# Altium schematic sheet 原理图.SchDoc: 声控电动窗帘控制器设计
size B; Organization: 河北科技大学; Revision: V1.0; SheetNumber: 1; SheetTotal: 1; Date: 2022/4/09; CheckedBy: 张刚; Author: 靳雅宁; Engineer: 180802205
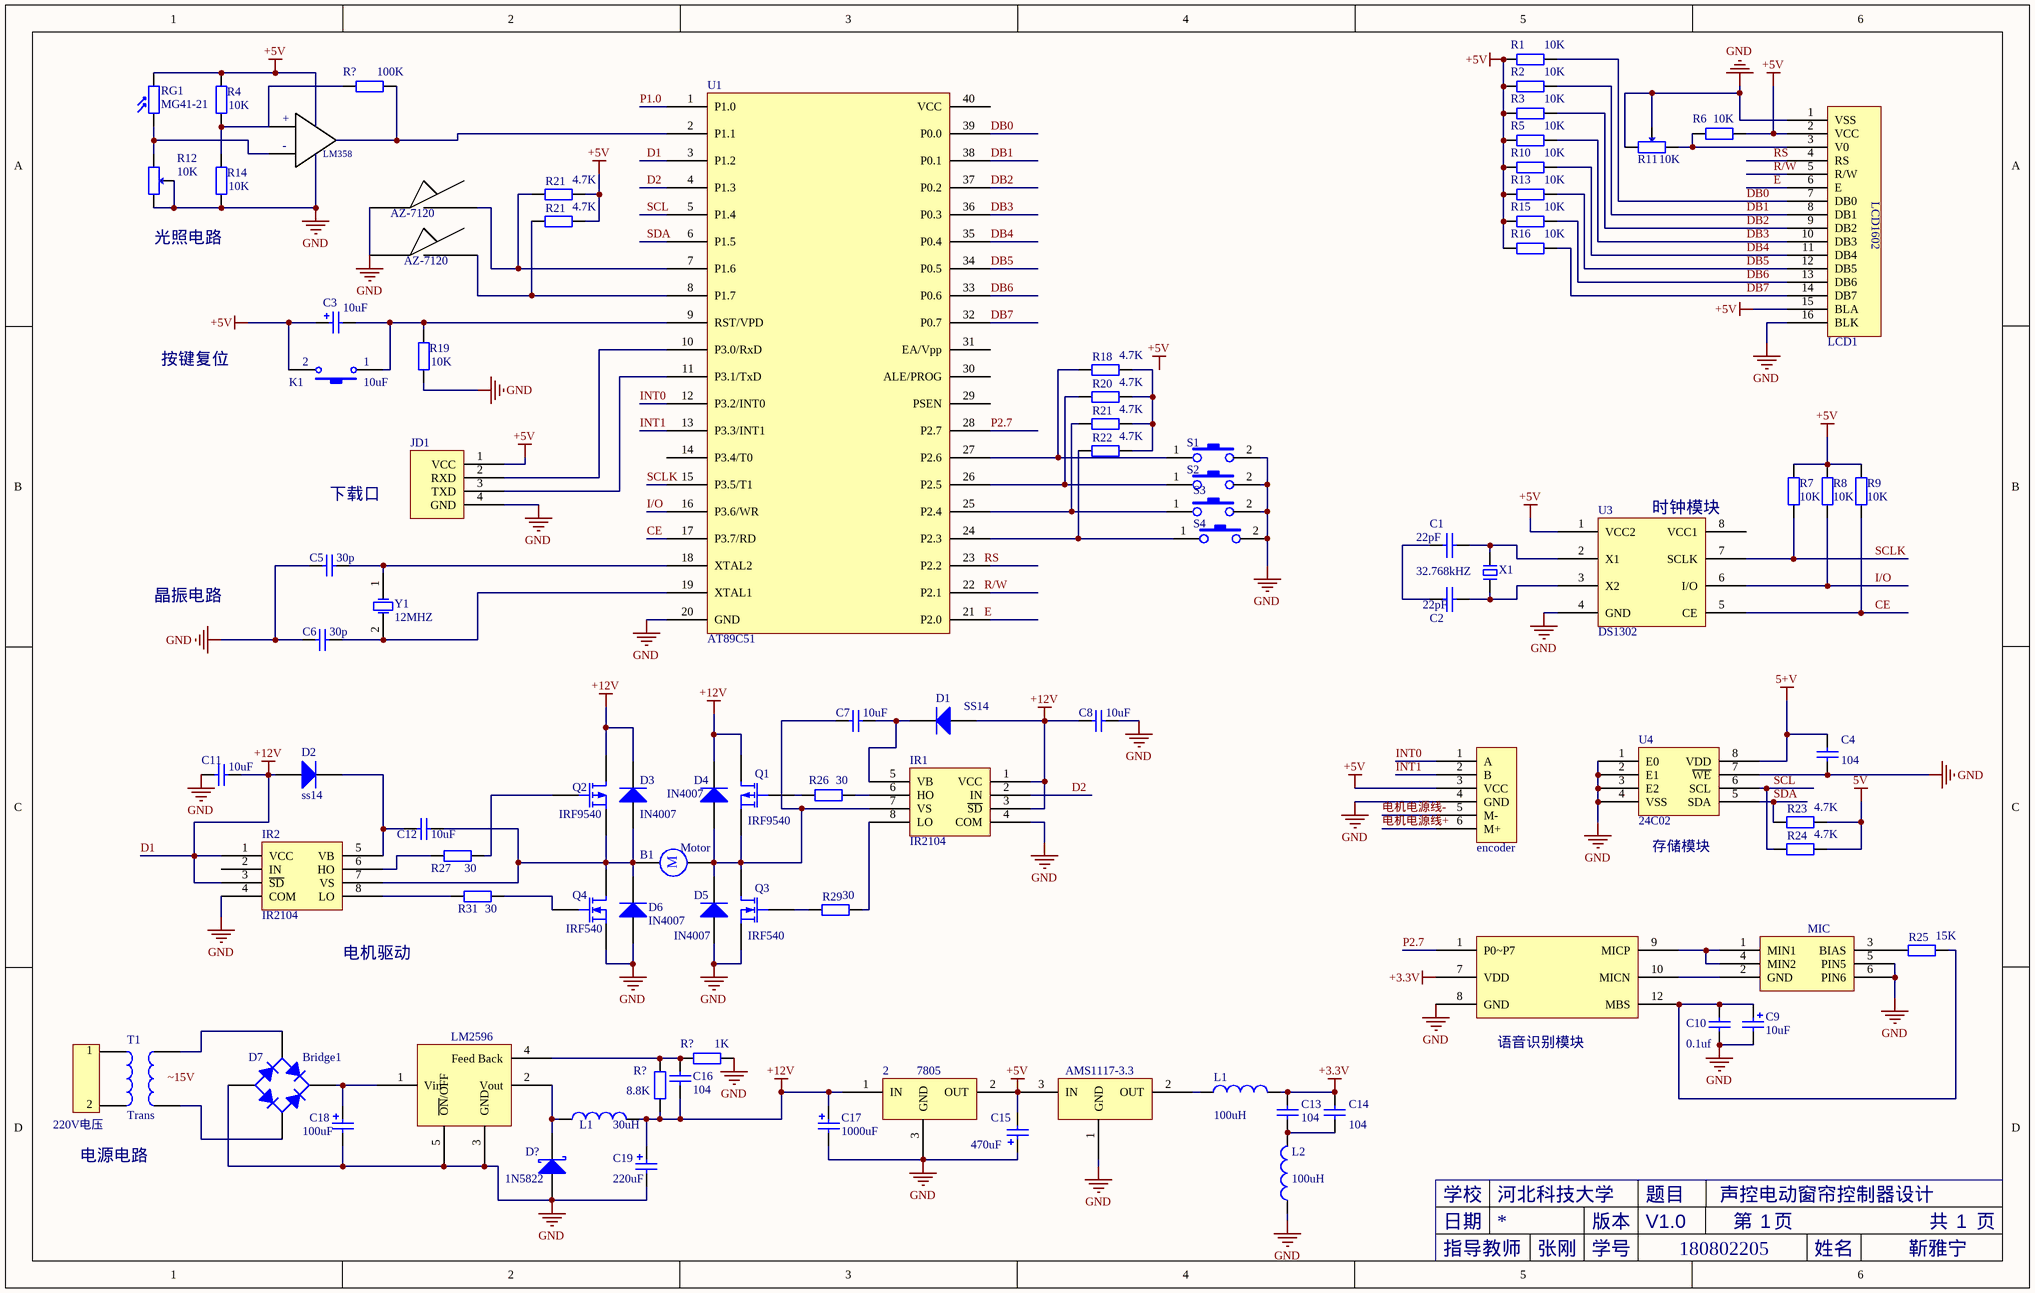
[diagram p0: 原理图.SchDoc]

## Parts
(Parts that share a designator on the sheet are numbered #1, #2 ... from top to bottom, then left to right.)
2  7805
*1  LM358
*2  语音识别模块
*3  MIC
*5  220V电压
*7  AMS1117-3.3
*#1  AZ-7120
*#2  AZ-7120
*#3  encoder
*#4  LM2596
B1  Motor  [RB5-10.5]
C1  22pF  [RAD-0.1]
C2  22pF  [RAD-0.1]
C3  value 10uF  [POLAR0.8]  (hidden comment: Cap Pol2)
C4  104  [RAD-0.3]
C5  value 30p  [RAD-0.3]  (hidden comment: Cap)
C6  value 30p  [RAD-0.3]  (hidden comment: Cap)
C7  value 10uF  [RAD-0.3]  (hidden comment: Cap)
C8  value 10uF  [RAD-0.3]  (hidden comment: Cap)
C9  value 10uF  [POLAR0.8]  (hidden comment: Cap Pol2)
C10  value 0.1uf  [RAD-0.3]  (hidden comment: Cap)
C11  value 10uF  [RAD-0.3]  (hidden comment: Cap)
C12  value 10uF  [RAD-0.3]  (hidden comment: Cap)
C13  value 104  [RAD-0.3]  (hidden comment: Cap)
C14  value 104  [RAD-0.3]  (hidden comment: Cap)
C15  value 470uF  [POLAR0.8]  (hidden comment: Cap Pol2)
C16  value 104  [RAD-0.3]  (hidden comment: Cap)
C17  value 1000uF  [POLAR0.8]  (hidden comment: Cap Pol2)
C18  value 100uF  [POLAR0.8]  (hidden comment: Cap Pol2)
C19  value 220uF  [POLAR0.8]  (hidden comment: Cap Pol2)
D1  SS14  [SMC]
D2  ss14  [SMC]
D3  IN4007  [SMC]
D4  IN4007  [SMC]
D5  IN4007  [SMC]
D6  IN4007  [SMC]
D7  Bridge1  [D-38]
D?  1N5822  [TO-220AC]
IR1  IR2104
IR2  IR2104
JD1  0  (value not drawn)
K1  10uF  [SPST-2]
L1#1  value 100uH  [0402-A]  (hidden comment: Inductor)
L1#2  value 30uH  [0402-A]  (hidden comment: Inductor)
L2  value 100uH  [0402-A]  (hidden comment: Inductor)
LCD1  LCD1  (value not drawn)
Q1  IRF9540  [E3]
Q2  IRF9540  [E3]
Q3  IRF540  [E3]
Q4  IRF540  [E3]
R1  value 10K  [AXIAL-0.4]  (hidden comment: Res2)
R2  value 10K  [AXIAL-0.4]  (hidden comment: Res2)
R3  value 10K  [AXIAL-0.4]  (hidden comment: Res2)
R4  value 10K  [AXIAL-0.4]  (hidden comment: Res2)
R5  value 10K  [AXIAL-0.4]  (hidden comment: Res2)
R6  value 10K  [AXIAL-0.4]  (hidden comment: Res2)
R7  value 10K  [AXIAL-0.4]  (hidden comment: Res2)
R8  value 10K  [AXIAL-0.4]  (hidden comment: Res2)
R9  value 10K  [AXIAL-0.4]  (hidden comment: Res2)
R10  value 10K  [AXIAL-0.4]  (hidden comment: Res2)
R11  10K  [3296W]
R12  10K  [3296W]
R13  value 10K  [AXIAL-0.4]  (hidden comment: Res2)
R14  value 10K  [AXIAL-0.4]  (hidden comment: Res2)
R15  value 10K  [AXIAL-0.4]  (hidden comment: Res2)
R16  value 10K  [AXIAL-0.4]  (hidden comment: Res2)
R18  value 4.7K  [AXIAL-0.4]  (hidden comment: Res2)
R19  value 10K  [AXIAL-0.4]  (hidden comment: Res2)
R20  value 4.7K  [AXIAL-0.4]  (hidden comment: Res2)
R21#1  value 4.7K  [AXIAL-0.4]  (hidden comment: Res2)
R21#2  value 4.7K  [AXIAL-0.4]  (hidden comment: Res2)
R21#3  value 4.7K  [AXIAL-0.4]  (hidden comment: Res2)
R22  value 4.7K  [AXIAL-0.4]  (hidden comment: Res2)
R23  value 4.7K  [AXIAL-0.4]  (hidden comment: Res2)
R24  value 4.7K  [AXIAL-0.4]  (hidden comment: Res2)
R25  value 15K  [AXIAL-0.4]  (hidden comment: Res2)
R26  value 30  [AXIAL-0.4]  (hidden comment: Res2)
R27  value 30  [AXIAL-0.4]  (hidden comment: Res2)
R29  value 30  [AXIAL-0.4]  (hidden comment: Res2)
R31  value 30  [AXIAL-0.4]  (hidden comment: Res2)
R?#1  value 100K  [AXIAL-0.4]  (hidden comment: Res2)
R?#2  value 1K  [AXIAL-0.4]  (hidden comment: Res2)
R?#3  value 8.8K  [AXIAL-0.4]  (hidden comment: Res2)
RG1  MG41-21  [RG5528]
S1  BUTTOM  [DIP-6X6X5]  (value not drawn)
S2  BUTTOM  [DIP-6X6X5]  (value not drawn)
S3  BUTTOM  [DIP-6X6X5]  (value not drawn)
S4  BUTTOM  [DIP-6X6X5]  (value not drawn)
T1  Trans  [TRANS]
U1  AT89C51
U3  DS1302  [DIP8]
U4  24C02
X1  32.768kHZ  [OSC-2x6-WI-A]
Y1  12MHZ  [R38]

## Nets
5+V: C4.2 U4.8(VDD)
5V: R23.2 R24.2
+3.3V: *2.7(VDD) C13.2 C14.2 L1#1.2
+5V: 2.2(OUT) *7.3(IN) *#3.3(VCC) C3.1 C15.2 JD1.1(VCC) K1.2 LCD1.2(VCC) LCD1.15(BLA) R1.2 R2.2 R3.2 R4.2 R5.2 R6.2 R7.2 R8.2 R9.2 R10.2 R13.2 R15.2 R16.2 R21#1.2 R21#2.2 RG1.2 U3.1(VCC2)
D1: 2.1(IN) C8.1 C11.2 C16.2 C17.1 C19.1 D1.1(A) D2.1(A) D3.2(K) D4.2(K) IR1.1(VCC) IR1.3(~{SD}) IR2.1(VCC) IR2.3(~{SD}) L1#2.2 Q1.1(D) Q2.1(D) R?#3.1 U1.3(P1.2)  [also labelled +12V]
GND: 2.3(GND) *2.8(GND) *3.5(PIN5) *3.6(PIN6) *7.1(GND) *#3.4(GND) *#4.3(GND) *#4.5(~{ON}/OFF) C4.1 C5.1 C6.1 C8.2 C9.2 C10.1 C11.1 C15.1 C17.2 C18.2 C19.2 D5.1(A) D6.1(A) D7.3(A) D?.3(A) IR1.4(COM) IR2.4(COM) JD1.4(GND) L2.1 LCD1.1(VSS) LCD1.16(BLK) Q3.3(S) Q4.3(S) R11.1 R11.2 R12.1 R12.2 R14.1 R19.1 R?#2.2 S1.2 S2.2 S3.2 S4.2 U1.20(GND) U3.4(GND) U4.1(E0) U4.2(E1) U4.3(E2) U4.4(VSS) U4.7(~{WE})
CE: R9.1 U1.17(P3.7/RD) U3.5(CE)
D2: IR1.2(IN) U1.4(P1.3)
DB0: LCD1.7(DB0) R1.1 U1.39(P0.0)
DB1: LCD1.8(DB1) R2.1 U1.38(P0.1)
DB2: LCD1.9(DB2) R3.1 U1.37(P0.2)
DB3: LCD1.10(DB3) R5.1 U1.36(P0.3)
DB4: LCD1.11(DB4) R10.1 U1.35(P0.4)
DB5: LCD1.12(DB5) R13.1 U1.34(P0.5)
DB6: LCD1.13(DB6) R15.1 U1.33(P0.6)
DB7: LCD1.14(DB7) R16.1 U1.32(P0.7)
E: LCD1.6(E)
I/O: R8.1 U1.16(P3.6/WR) U3.6(I/O)
INT0: *#3.1(A) U1.12(P3.2/INT0)
INT1: *#3.2(B) U1.13(P3.3/INT1)
P1.0: U1.1(P1.0)
P2.7: *2.1(P0~P7) U1.28(P2.7)
R/W: LCD1.5(R/W)
RS: LCD1.4(RS)
SCL: R24.1 U1.5(P1.4) U4.6(SCL)
SCLK: R7.1 U1.15(P3.5/T1) U3.7(SCLK)
SDA: R23.1 U1.6(P1.5) U4.5(SDA)
电机电源线+: *#3.6(M+)
电机电源线-: *#3.5(M-)
Net*2_9: *2.9(MICP) *3.1(MIN1) *3.4(MIN2)
Net*2_10: *2.10(MICN) *3.2(GND)
Net*2_12: *2.12(MBS) C9.1 C10.2 R25.2
Net*3_3: *3.3(BIAS) R25.1
Net*7_2: *7.2(OUT) L1#1.1
Net*#4_1: *#4.1(Vin) C18.1 D7.1(K)
Net*#4_2: *#4.2(Vout) D?.1(K) L1#2.1
Net*#4_4: *#4.4(Feed_Back) C16.1 R?#2.1 R?#3.2
NetB1_1: B1.1 C12.2 D3.1(A) D6.2(K) IR2.7(VS) Q2.3(S) Q4.1(D)
NetB1_2: B1.2 C7.1 D4.1(A) D5.2(K) IR1.7(VS) Q1.3(S) Q3.1(D)
NetC1_1: C1.1 C2.1
NetC1_2: C1.2 U3.2(X1) X1.2
NetC2_2: C2.2 U3.3(X2) X1.1
NetC3_2: C3.2 K1.1 R19.2 U1.9(RST/VPD)
NetC5_2: C5.2 U1.18(XTAL2) Y1.1(OSC1)
NetC6_2: C6.2 U1.19(XTAL1) Y1.2(OSC2)
NetC7_2: C7.2 D1.2(K) IR1.5(VB)
NetC12_1: C12.1 D2.2(K) IR2.5(VB)
NetC13_1: C13.1 C14.1 L2.2
NetD7_2: D7.2(C) T1.4
NetD7_4: D7.4(C) T1.3
NetIR1_6: IR1.6(HO) R26.2
NetIR1_8: IR1.8(LO) R29.2
NetIR2_6: IR2.6(HO) R27.1
NetIR2_8: IR2.8(LO) R31.1
NetJD1_2: JD1.2(RXD) U1.10(P3.0/RxD)
NetJD1_3: JD1.3(TXD) U1.11(P3.1/TxD)
NetLCD1_3: LCD1.3(V0) R6.1 R11.3
NetQ1_2: Q1.2(G) R26.1
NetQ2_2: Q2.2(G) R27.2
NetQ3_2: Q3.2(G) R29.1
NetQ4_2: Q4.2(G) R31.2
NetR4_1: R4.1 R14.2 R?#1.1
NetR12_3: R12.3 RG1.1
NetR18_1: R18.1 S1.1 U1.27(P2.6)
NetR18_2: R18.2 R20.2 R21#3.2 R22.2
NetR20_1: R20.1 S2.1 U1.26(P2.5)
NetR21#1_1: R21#1.1 U1.7(P1.6)
NetR21#2_1: R21#2.1 U1.8(P1.7)
NetR21#3_1: R21#3.1 S3.1 U1.25(P2.4)
NetR22_1: R22.1 S4.1 U1.24(P2.3)
NetR?#1_2: R?#1.2 U1.2(P1.1)

Not connected (* = marked no-connect by the designer): IR2 2(IN); T1 1 2; U1 14(P3.4/T0) 21(P2.0) 22(P2.1) 23(P2.2) 29(PSEN) 30(ALE/PROG) 31(EA/Vpp) 40(VCC); U3 8(VCC1)

## Notes on the sheet
- 光照电路
- 按键复位
- (near K1) 2
- (near K1) 1
- 下载口
- (near U3) 时钟模块
- 晶振电路
- (near U4) 存储模块
- (near IR2) 电机驱动
- (near T1) 电源电路
- 学校
- 日期
- 版本
- 题目
- 第
- 页
- 共
- 指导教师
- 学号
- 180802205
- 姓名
- 靳雅宁
- Labels drawn without touching a wire or pin: +5V, E, R/W, RS, ~15V
- (in symbol 220V电压) 1; 2
- (in symbol Component_1) LCD1602
- (in symbol LM385A) +; -
- (in symbol Motor) M

## Library data of the parts
*1 = LM385A
*7 = AMS1117-3
*#1 *#2 = 行程开关（常开）
B1 = Motor: Motor, General Kind; Published: 24-Mar-1999; LatestRevisionDate: 17-Jul-2002; LatestRevisionNote: Re-released for DXP Platform.; PackageReference: RB5-10.5; Publisher: Altium Limited; PackageDescription: Capacitor (Radial); 2 Leads
C1 C2 = CAP: 无极性电容
C3 C9 C15 C17-C19 = Cap Pol2: Polarized Capacitor (Axial); Published: 8-Jun-2000; LatestRevisionDate: 17-Jul-2002; LatestRevisionNote: Re-released for DXP Platform.; PackageReference: POLAR0.8; Publisher: Altium Limited; PackageDescription: Polarized Capacitor; 2 Leads
C4 = Cap: Capacitor; Value: 100pF; Published: 8-Jun-2000; LatestRevisionDate: 17-Jul-2002; LatestRevisionNote: Re-released for DXP Platform.; PackageReference: RAD-0.3; Publisher: Altium Limited; PackageDescription: Radial Cap, Thru-Hole; 2 Leads; 0.3 in Pin Spacing
C5-C8 C10-C14 C16 = Cap: Capacitor; Published: 8-Jun-2000; LatestRevisionDate: 17-Jul-2002; LatestRevisionNote: Re-released for DXP Platform.; PackageReference: RAD-0.3; Publisher: Altium Limited; PackageDescription: Radial Cap, Thru-Hole; 2 Leads; 0.3 in Pin Spacing
D1-D6 = Diode: Default Diode; Published: 8-Jun-2000; LatestRevisionDate: 17-Jul-2002; LatestRevisionNote: Re-released for DXP Platform.; PackageVersion: Sep-1996; PackageReference: SMC; Publisher: Altium Limited; PackageDescription: DO-214-AB/SMC; 2 C-Bend Leads; Body 7.9 x 5.9 mm, inc. leads (LxW); Code_JEDEC: DO-214-AB
D7 = Bridge1: Full Wave Diode Bridge; Published: 8-Jun-2000; LatestRevisionDate: 29-May-2009; LatestRevisionNote: Sch pins A & K swapped.; DatasheetVersion: E2732B; PackageReference: D-38; Publisher: Altium Limited; PackageDescription: Bridge Rectifier; 4 Terminals; Body 9.4 x 9.4 mm (typ); Pitch 5.08 mm
D? = Diode 10TQ040: Schottky Rectifier; Note: Terminal 2 is the TAB and is electrically connected to the cathode; Published: 8-Jun-2000; LatestRevisionDate: 17-Jul-2002; LatestRevisionNote: Re-released for DXP Platform.; DatasheetVersion: PD-2.057B; PackageVersion: Feb-1998; PackageReference: TO-220AC; Publisher: Altium Limited; PackageDescription: TO, Thru-Hole, Vertical, Heatsink Mounted; 3 In-Line Leads (1 Absent); Pitch 2.54 mm; ComponentLink1Description: Manufacturer Link; ComponentLink1URL: http://www.irf.com/
JD1 LCD1 = Component_1
K1 = SW-PB: Switch; Published: 24-Mar-1999; LatestRevisionDate: 17-Jul-2002; LatestRevisionNote: Re-released for DXP Platform.; PackageReference: SPST-2; Publisher: Altium Limited; PackageDescription: Switch; 2 Leads
L1#1 L1#2 L2 = Inductor: Code_IEC: 1005; Published: 8-Jun-2000; LatestRevisionDate: 29-May-2009; LatestRevisionNote: IPC-7351 Footprint Added.; PackageReference: 0402-A; Publisher: Altium Limited; PackageDescription: Chip Inductor; Code_JEITA: 0402
Q1 Q2 = MOSFET-P: P-Channel MOSFET; Published: 8-Jun-2000; LatestRevisionDate: 17-Jul-2002; LatestRevisionNote: Re-released for DXP Platform.; PackageVersion: 1995/1996; PackageReference: E3; Publisher: Altium Limited; PackageDescription: TO, Flat Index; 3 In-Line, Axial Leads; Body Dia. 4.6mm; Lead Dia. 0.5 mm (max)
Q3 Q4 = MOSFET-N: N-Channel MOSFET; Published: 8-Jun-2000; LatestRevisionDate: 17-Jul-2002; LatestRevisionNote: Re-released for DXP Platform.; PackageVersion: 1995/1996; PackageReference: E3; Publisher: Altium Limited; PackageDescription: TO, Flat Index; 3 In-Line, Axial Leads; Body Dia. 4.6mm; Lead Dia. 0.5 mm (max)
R1-R10 R13-R16 R18-R20 R21#1-R21#3 R22-R27 R29 R31 R?#1-R?#3 = Res2: Resistor; Published: 8-Jun-2000; LatestRevisionDate: 17-Jul-2002; LatestRevisionNote: Re-released for DXP Platform.; PackageReference: AXIAL-0.4; Publisher: Altium Limited; PackageDescription: Axial Device, Thru-Hole; 2 Leads; 0.4 in Pin Spacing
R11 R12 = RP: 单联电位器; BOM名称: 插件电位器; 版权归属: 封装库来自淘宝 ID：黄晶宝石; 联系售后: https://shop463601444.taobao.com
RG1 = RG: 光敏电阻; 版权归属: 封装库来自淘宝 ID：黄晶宝石; BOM名称: 光敏电阻; 学习资源: https://shop463601444.taobao.com
S1-S4 = BUTTOM: 按键
T1 = Trans: Transformer; Published: 24-Mar-1999; LatestRevisionDate: 08-Jul-2005; LatestRevisionNote: Mech Layer 1 removed.; PackageReference: TRANS; Publisher: Altium Limited; PackageDescription: Transformer; 4 Leads
X1 = XTAL-2P: 2脚无源脚晶振
Y1 = XTAL: Crystal Oscillator; Published: 8-Jun-2000; LatestRevisionDate: 17-Jul-2002; LatestRevisionNote: Re-released for DXP Platform.; PackageReference: R38; Publisher: Altium Limited; PackageDescription: Crystal, Thru-Hole; 2 Leads; Body 3.1 x 8.2 mm (Dia.xH)